# EAGLE design ISPnub_v1.0 (EAGLE 7.2.0)
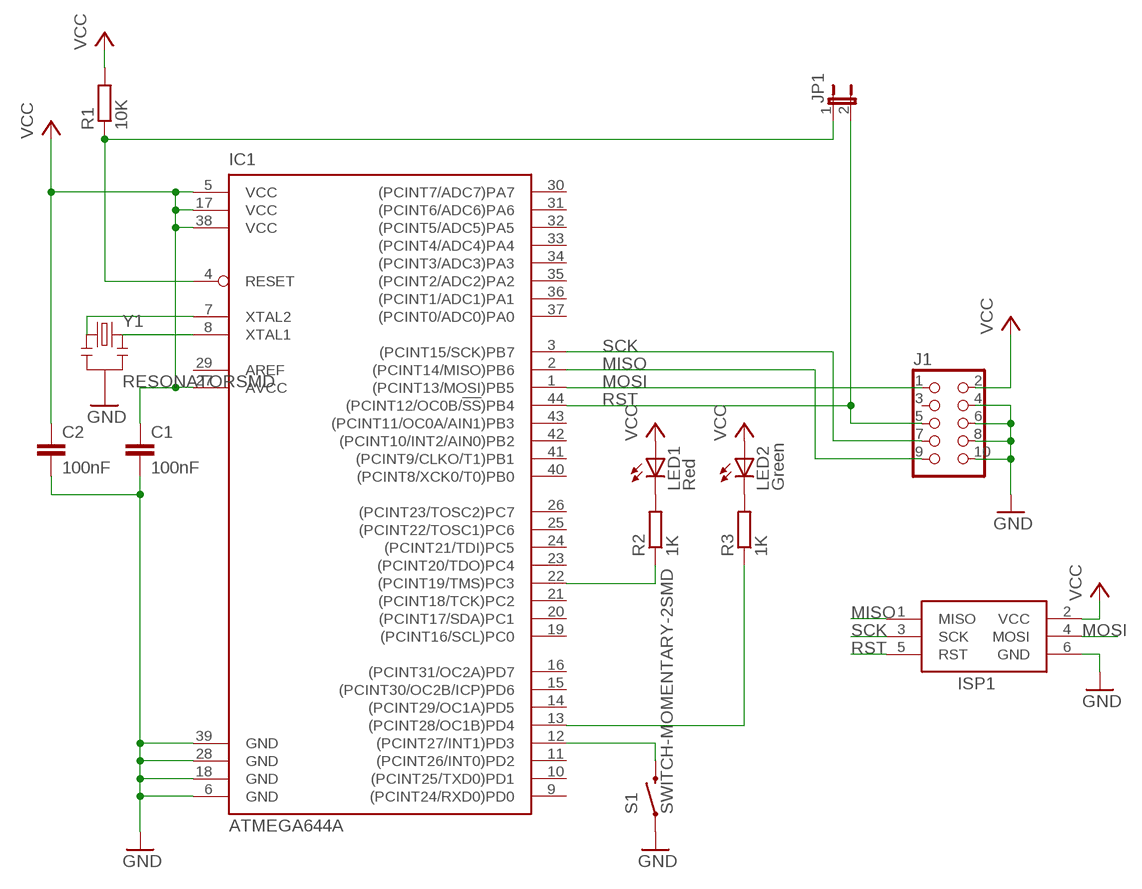
[diagram p0: schematic, sheet 1]

## Parts
C1  100nF  C-EUC0805  [C0805]
C2  100nF  C-EUC0805  [C0805]
IC1  ATMEGA644A  [TQFP44]
ISP1  AVRISP-BOX  [AVRISP-BOX]
J1  CON_HEADER_2X05-PTH+SHROUDED_A  [PINSHRD_PTH_2X05]
JP1  JP1E  [JP1]
LED1  Red  LEDCHIP-LED0805  [CHIP-LED0805]
LED2  Green  LEDCHIP-LED0805  [CHIP-LED0805]
R1  10K  R-EU_R0805  [R0805]
R2  1K  R-EU_R0805  [R0805]
R3  1K  R-EU_R0805  [R0805]
S1  SWITCH-MOMENTARY-2SMD  [TACTILE_SWITCH_SMD]
Y1  RESONATORSMD  [RESONATOR-SMD]

## Nets
GND: C1.2 C2.2 IC1.6(GND) IC1.18(GND) IC1.28(GND) IC1.39(GND) ISP1.6(GND) J1.4 J1.6 J1.8 J1.10 S1.1 Y1.2
MISO: IC1.2((PCINT14/MISO)PB6) ISP1.1(MISO) J1.9
MOSI: IC1.1((PCINT13/MOSI)PB5) ISP1.4(MOSI) J1.1
N$1: IC1.4(RESET) JP1.1 R1.1
N$2: IC1.8(XTAL1) Y1.3
N$3: IC1.7(XTAL2) Y1.1
N$4: IC1.12((PCINT27/INT1)PD3) S1.3
N$5: IC1.13((PCINT28/OC1B)PD4) R3.1
N$6: LED2.C R3.2
N$7: IC1.22((PCINT19/TMS)PC3) R2.1
N$8: LED1.C R2.2
RST: IC1.44((PCINT12/OC0B/!SS!)PB4) ISP1.5(RST) J1.5 JP1.2
SCK: IC1.3((PCINT15/SCK)PB7) ISP1.3(SCK) J1.7
VCC: C1.1 C2.1 IC1.5(VCC) IC1.17(VCC) IC1.27(AVCC) IC1.38(VCC) ISP1.2(VCC) J1.2 LED1.A LED2.A R1.2
Unconnected: IC1.9((PCINT24/RXD0)PD0) IC1.10((PCINT25/TXD0)PD1) IC1.11((PCINT26/INT0)PD2) IC1.14((PCINT29/OC1A)PD5) IC1.15((PCINT30/OC2B/ICP)PD6) IC1.16((PCINT31/OC2A)PD7) IC1.19((PCINT16/SCL)PC0) IC1.20((PCINT17/SDA)PC1) IC1.21((PCINT18/TCK)PC2) IC1.23((PCINT20/TDO)PC4) IC1.24((PCINT21/TDI)PC5) IC1.25((PCINT22/TOSC1)PC6) IC1.26((PCINT23/TOSC2)PC7) IC1.29(AREF) IC1.30((PCINT7/ADC7)PA7) IC1.31((PCINT6/ADC6)PA6) IC1.32((PCINT5/ADC5)PA5) IC1.33((PCINT4/ADC4)PA4) IC1.34((PCINT3/ADC3)PA3) IC1.35((PCINT2/ADC2)PA2) IC1.36((PCINT1/ADC1)PA1) IC1.37((PCINT0/ADC0)PA0) IC1.40((PCINT8/XCK0/T0)PB0) IC1.41((PCINT9/CLKO/T1)PB1) IC1.42((PCINT10/INT2/AIN0)PB2) IC1.43((PCINT11/OC0A/AIN1)PB3) J1.3

## Library data of the parts
C1 C2 = rcl:C-EU: CAPACITOR, European symbol; MOUSER#: 80-C0805C104K5R
IC1 = atmel:ATMEGA644: 8-bit Microcontroller with 64K Bytes In-System Programmable Flash Source: http://www.atmel.com/dyn/resources/prod_documents/doc2593.pdf; MOUSER#: 556-ATMEGA1284P-AU; MPN: ATMEGA1284PV-10AU; OC_FARNELL: 1455123; OC_NEWARK: 58M3748
ISP1 = adafruit:AVRISP: AVR ISP HEADER Standard 6 pin header for AVR programming
J1 = dp_devices:CON_HEADER_2X05: 2x05 pin header; MOUSER#: 517-N2510-5002RB
JP1 = jumper:JP1E: JUMPER; MOUSER#: 571-826936-2
LED1 = led:LED: LED OSRAM: - CHIPLED LG R971, LG N971, LY N971, LG Q971, LY Q971, LO R971, LY R971 LH N974, LH R974 LS Q976, LO Q976, LY Q976 LO Q996 - Hyper CHIPLED LW Q18S LB Q993, LB Q99A, LB R99A - SideLED LS A670, LO A670, LY A670, LG A670, LP A670 LB A673, LV A673, LT A673, LW A673 LH A674 LY A675 LS A676, LA A676, LO A676, LY A676, LW A676 LS A679, LY A679, LG A679 - Hyper Micro SIDELED® LS Y876, LA Y876, LO Y876, LY Y876 LT Y87S - SmartLED LW L88C, LW L88S LB L89C, LB L89S, LG L890 LS L89K, LO L89K, LY L89K LS L896, LA L896, LO L896, LY L896 - TOPLED LS T670, LO T670, LY T670, LG T670, LP T670 LSG T670, LSP T670, LSY T670, LOP T670, LYG T670 LG T671, LOG T671, LSG T671 LB T673, LV T673, LT T673, LW T673 LH T674 LS T676, LA T676, LO T676, LY T676, LB T676, LH T676, LSB T676, LW T676 LB T67C, LV T67C, LT T67C, LS T67K, LO T67K, LY T67K, LW E67C LS E67B, LA E67B, LO E67B, LY E67B, LB E67C, LV E67C, LT E67C LW T67C LS T679, LY T679, LG T679 LS T770, LO T770, LY T770, LG T770, LP T770 LB T773, LV T773, LT T773, LW T773 LH T774 LS E675, LA E675, LY E675, LS T675 LS T776, LA T776, LO T776, LY T776, LB T776 LHGB T686 LT T68C, LB T68C - Hyper Mini TOPLED® LB M676 - Mini TOPLED Santana® LG M470 LS M47K, LO M47K, LY M47K Source: http://www.osram.convergy.de LUXEON: - LUMILED® LXK2-PW12-R00, LXK2-PW12-S00, LXK2-PW14-U00, LXK2-PW14-V00 LXK2-PM12-R00, LXK2-PM12-S00, LXK2-PM14-U00 LXK2-PE12-Q00, LXK2-PE12-R00, LXK2-PE12-S00, LXK2-PE14-T00, LXK2-PE14-U00 LXK2-PB12-K00, LXK2-PB12-L00, LXK2-PB12-M00, LXK2-PB14-N00, LXK2-PB14-P00, LXK2-PB14-Q00 LXK2-PR12-L00, LXK2-PR12-M00, LXK2-PR14-Q00, LXK2-PR14-R00 LXK2-PD12-Q00, LXK2-PD12-R00, LXK2-PD12-S00 LXK2-PH12-R00, LXK2-PH12-S00 LXK2-PL12-P00, LXK2-PL12-Q00, LXK2-PL12-R00 Source: www.luxeon.com KINGBRIGHT: KA-3528ASYC Source: www.kingbright.com; MOUSER#: 604-APT1608SURC
LED2 = led:LED: LED OSRAM: - CHIPLED LG R971, LG N971, LY N971, LG Q971, LY Q971, LO R971, LY R971 LH N974, LH R974 LS Q976, LO Q976, LY Q976 LO Q996 - Hyper CHIPLED LW Q18S LB Q993, LB Q99A, LB R99A - SideLED LS A670, LO A670, LY A670, LG A670, LP A670 LB A673, LV A673, LT A673, LW A673 LH A674 LY A675 LS A676, LA A676, LO A676, LY A676, LW A676 LS A679, LY A679, LG A679 - Hyper Micro SIDELED® LS Y876, LA Y876, LO Y876, LY Y876 LT Y87S - SmartLED LW L88C, LW L88S LB L89C, LB L89S, LG L890 LS L89K, LO L89K, LY L89K LS L896, LA L896, LO L896, LY L896 - TOPLED LS T670, LO T670, LY T670, LG T670, LP T670 LSG T670, LSP T670, LSY T670, LOP T670, LYG T670 LG T671, LOG T671, LSG T671 LB T673, LV T673, LT T673, LW T673 LH T674 LS T676, LA T676, LO T676, LY T676, LB T676, LH T676, LSB T676, LW T676 LB T67C, LV T67C, LT T67C, LS T67K, LO T67K, LY T67K, LW E67C LS E67B, LA E67B, LO E67B, LY E67B, LB E67C, LV E67C, LT E67C LW T67C LS T679, LY T679, LG T679 LS T770, LO T770, LY T770, LG T770, LP T770 LB T773, LV T773, LT T773, LW T773 LH T774 LS E675, LA E675, LY E675, LS T675 LS T776, LA T776, LO T776, LY T776, LB T776 LHGB T686 LT T68C, LB T68C - Hyper Mini TOPLED® LB M676 - Mini TOPLED Santana® LG M470 LS M47K, LO M47K, LY M47K Source: http://www.osram.convergy.de LUXEON: - LUMILED® LXK2-PW12-R00, LXK2-PW12-S00, LXK2-PW14-U00, LXK2-PW14-V00 LXK2-PM12-R00, LXK2-PM12-S00, LXK2-PM14-U00 LXK2-PE12-Q00, LXK2-PE12-R00, LXK2-PE12-S00, LXK2-PE14-T00, LXK2-PE14-U00 LXK2-PB12-K00, LXK2-PB12-L00, LXK2-PB12-M00, LXK2-PB14-N00, LXK2-PB14-P00, LXK2-PB14-Q00 LXK2-PR12-L00, LXK2-PR12-M00, LXK2-PR14-Q00, LXK2-PR14-R00 LXK2-PD12-Q00, LXK2-PD12-R00, LXK2-PD12-S00 LXK2-PH12-R00, LXK2-PH12-S00 LXK2-PL12-P00, LXK2-PL12-Q00, LXK2-PL12-R00 Source: www.luxeon.com KINGBRIGHT: KA-3528ASYC Source: www.kingbright.com; MOUSER#: 604-APT2012SGC
R1 = rcl:R-EU_: RESISTOR, European symbol; MOUSER#: 603-SR0805JR-0710KL
R2 R3 = rcl:R-EU_: RESISTOR, European symbol; MOUSER#: 71-CRCW0805-1.0K-E3
S1 = Arduino-Pro-Mini-v14Arduino-Pro-Mini:SWITCH-MOMENTARY-2: Various NO switches- pushbuttons, reed, etc; MOUSER#: 693-1301.9314; PROD_ID: SWCH-08247
Y1 = Arduino-Pro-Mini-v14Arduino-Pro-Mini:RESONATOR: Resonator Small SMD resonator. This is the itty bitty 10/20MHz resonators with built in caps. CSTCE10M0G55 and CSTCE20M0V53. Footprint for SMD has been used in SFE production for years, and does work okay. 1:1 is an attempt to get larger fillets on the sides so it will be easier to inspect these solders in our AOI machine. The pads have been minimized to match the actual metal under the resonator. To see this relation, it includes an image import of the bottom side of the component. Imported to scale on layer 200.

## Board
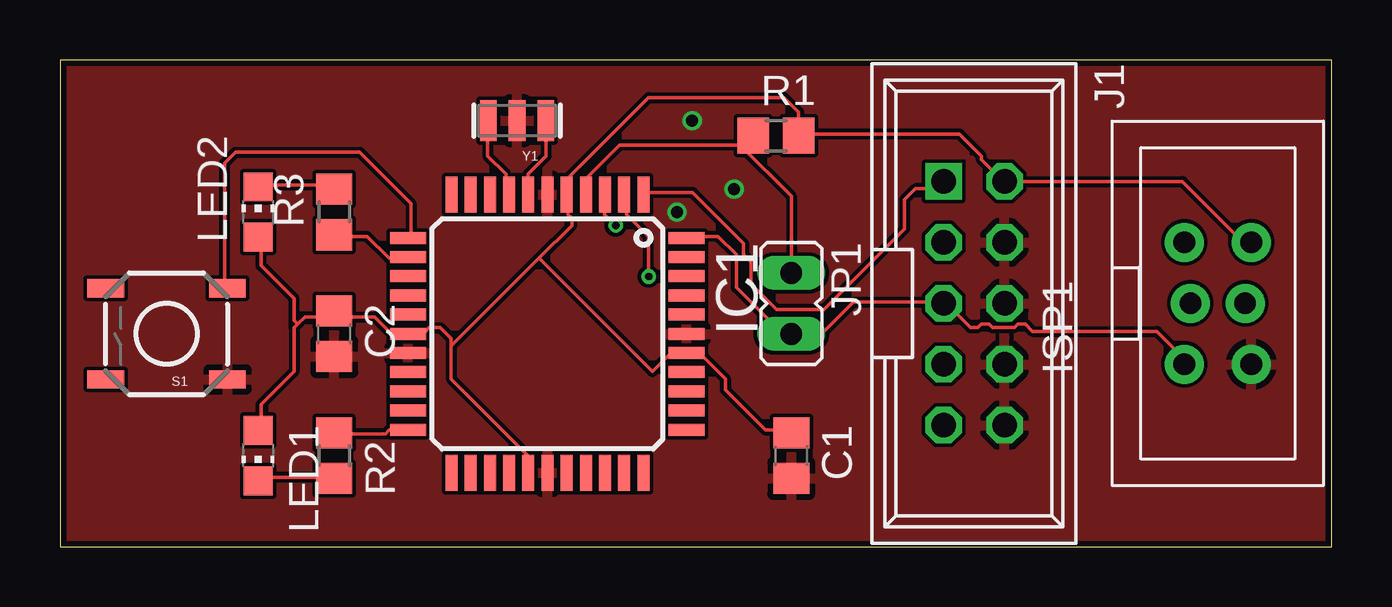
[diagram p1: board, top side]
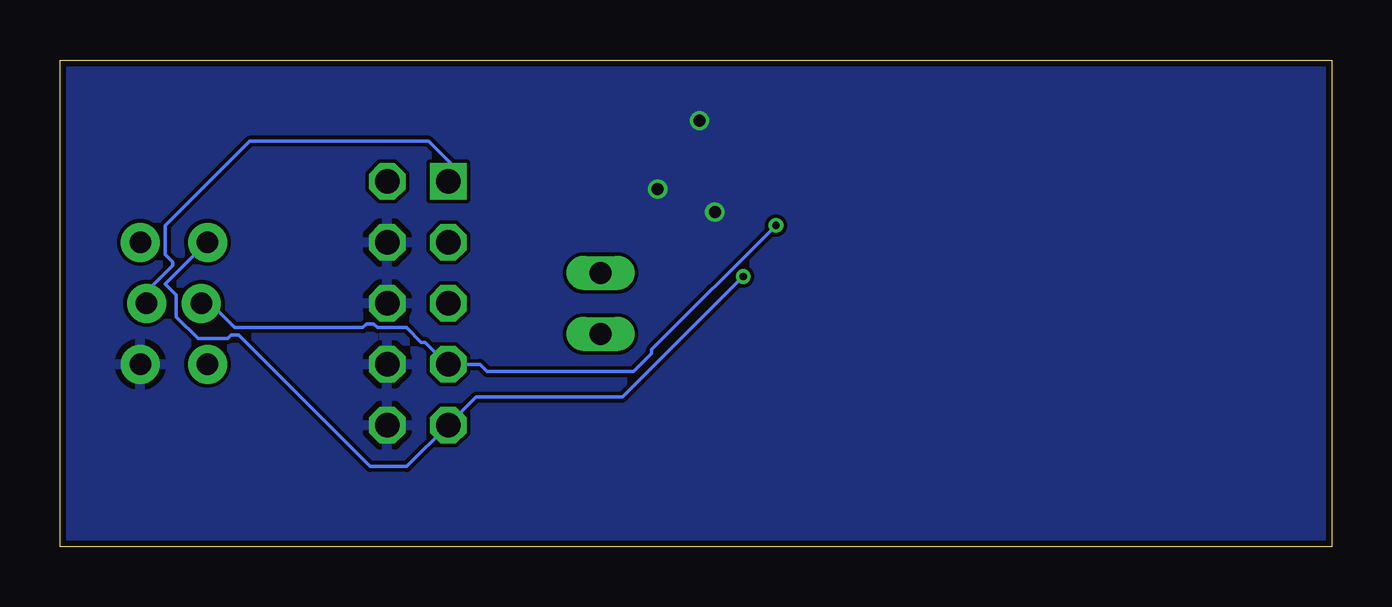
[diagram p2: board, bottom side, seen from below]

Size 53.01 x 20.31 mm. Coordinates in mm from the lower left corner, seen from the top.
Outline: 0,0 53.01,0 53.01,20.31 0,20.31 0,0
Copper layers (1*16): Top 0.035mm / dielectric 1.5mm / Bottom 0.035mm
Design rules "Elecrow_2-layer_eagle_rule": minimum track width 6mil, minimum drill 12mil, track to track 6mil, track to pad 6mil, pad to pad 6mil, via to via 6mil, smd to smd 0mil, copper to edge 10mil, drill to drill 10mil, minimum pad ring 10mil, minimum via ring 6mil, stop-mask expansion 2mil, vias tented up to drill 100mil, thermal gap 10mil

### Footprints (pad centres in the part's own frame; a part is rotated, then mirrored left to right if it is on the bottom)
C0805 = smd 1.3 x 1.5: 1 -0.95,0; 2 0.95,0
TQFP44 = smd 1.5 x 0.5: 1 -5.8,4; 2 -5.8,3.2; 3 -5.8,2.4; 4 -5.8,1.6; 5 -5.8,0.8; 6 -5.8,0; 7 -5.8,-0.8; 8 -5.8,-1.6; 9 -5.8,-2.4; 10 -5.8,-3.2; 11 -5.8,-4; 23 5.8,-4; 24 5.8,-3.2; 25 5.8,-2.4; 26 5.8,-1.6; 27 5.8,-0.8; 28 5.8,0; 29 5.8,0.8; 30 5.8,1.6; 31 5.8,2.4; 32 5.8,3.2; 33 5.8,4 | smd 0.5 x 1.5: 12 -4,-5.8; 13 -3.2,-5.8; 14 -2.4,-5.8; 15 -1.6,-5.8; 16 -0.8,-5.8; 17 0,-5.8; 18 0.8,-5.8; 19 1.6,-5.8; 20 2.4,-5.8; 21 3.2,-5.8; 22 4,-5.8; 34 4,5.8; 35 3.2,5.8; 36 2.4,5.8; 37 1.6,5.8; 38 0.8,5.8; 39 0,5.8; 40 -0.8,5.8; 41 -1.6,5.8; 42 -2.4,5.8; 43 -3.2,5.8; 44 -4,5.8
AVRISP-BOX = drill 0.9 pad 1.626: 1 -1.397,2.54; 2 1.397,2.54; 3 -1.143,0; 4 1.143,0; 5 -1.397,-2.54; 6 1.397,-2.54
PINSHRD_PTH_2X05 = drill 1.016 square: 1 -5.08,-1.27 | drill 1.016 octagon: 2 -5.08,1.27; 3 -2.54,-1.27; 4 -2.54,1.27; 5 0,-1.27; 6 0,1.27; 7 2.54,-1.27; 8 2.54,1.27; 9 5.08,-1.27; 10 5.08,1.27
JP1 = drill 0.914 long: 1 0,-1.27; 2 0,1.27
CHIP-LED0805 = smd 1.2 x 1.2: A 0,-1.05; C 0,1.05
R0805 = smd 1.3 x 1.5: 1 -0.95,0; 2 0.95,0
TACTILE_SWITCH_SMD = smd 1.524 x 0.762: 1 -2.54,1.905; 2 2.54,1.905; 3 -2.54,-1.905; 4 2.54,-1.905
RESONATOR-SMD = smd 0.7 x 1.7: 1 -1.2,0; 2 0,0; 3 1.2,0

### Placement (x,y rotation side)
C1  30.48,3.81 270 top
C2  11.43,8.89 270 top
IC1  20.32,8.89 270 top
ISP1  48.26,10.16 0 top
J1  38.1,10.16 270 top
JP1  30.48,10.16 180 top
LED1  8.26,3.81 180 top
LED2  8.26,13.97 0 top
R1  29.84,17.14 0 top
R2  11.43,3.81 270 top
R3  11.43,13.97 90 top
S1  4.45,8.89 180 top
Y1  19.05,17.78 180 top

### Tracks (layer width: path | path; a pad name or v marks a point on that pad's centre or on a via)
GND  (via drill 0.5)
  other vias: 28.1,14.92 26.35,17.78 25.72,13.97
  pour Top: 0,0 53.34,0 53.34,20.32 0,20.32
  pour Bottom: 0,0 53.34,0 53.34,20.32 0,20.32
MISO  (via drill 0.3)
  Top 0.152: v24.54,11.28 24.54,12.95 23.62,13.87 23.62,14.63 IC1.2
  Bottom 0.152: v24.54,11.28 29.57,6.25 35.66,6.25 J1.9 38.56,3.35 40.08,3.35 45.57,8.84 45.87,8.84 46.02,8.69 47.24,8.69 48.16,9.6 48.16,10.52 48.62,10.97 46.94,12.65 ISP1.1
MOSI
  Top 0.152: IC1.1 24.38,14.78 26.36,14.78 28.5,12.65 28.5,12.19 28.8,11.89 28.8,10.97 29.87,9.91 31.85,9.91 35.2,13.26 35.2,14.48 35.66,14.94 36.42,14.94 36.73,15.24 J1.1
  Bottom 0.152: ISP1.4 49.38,10.21 49.38,10.67 48.31,11.73 48.31,11.89 48.62,12.19 48.62,13.41 45.11,16.92 37.64,16.92 36.73,16 36.73,15.24 J1.1
N$1
  Top 0.152: 28.35,16.76 28.5,16.76 28.8,17.07 R1.1 28.35,16.76 | 28.35,16.76 23.32,16.76 21.95,15.39 21.95,14.78 IC1.4 | JP1.1 30.48,14.63 28.35,16.76
N$2
  Top 0.152: IC1.8 18.59,14.78 18.59,15.54 17.83,16.31 17.83,17.68 Y1.3
N$3
  Top 0.152: IC1.7 19.51,14.78 19.51,15.54 19.81,15.85 19.81,15.84 20.27,16.3 20.27,17.68 Y1.1
N$4
  Top 0.152: IC1.12 14.63,12.95 14.63,14.33 12.5,16.46 7.32,16.46 6.86,16 6.86,10.82 S1.3
N$5
  Top 0.152: R3.1 11.43,12.95 12.8,12.95 13.72,12.04 14.48,12.04 IC1.13
N$6
  Top 0.152: LED2.C 8.38,15.09 11.28,15.09 11.43,14.94 R3.2
N$7
  Top 0.152: R2.1 11.43,4.72 13.56,4.72 13.72,4.88 14.48,4.88 IC1.22
N$8
  Top 0.152: LED1.C 8.38,2.9 11.43,2.9 R2.2
RST
  Top 0.152: 30.48,8.99 30.02,8.99 28.19,10.82 28.19,12.19 27.43,12.95 26.21,12.95 IC1.44 | 30.48,8.99 31.85,8.99 33.07,10.21 36.73,10.21 J1.5 36.88,10.21 37.95,9.14 38.25,9.14 38.41,9.3 38.71,9.3 38.86,9.14 39.78,9.14 39.93,9.3 40.23,9.3 40.54,8.99 45.72,8.99 46.79,7.92 46.79,7.62 ISP1.5 | 30.48,8.99 JP1.2
SCK  (via drill 0.3)
  Top 0.152: v23.16,13.41 22.71,13.87 22.71,14.63 IC1.3
  Bottom 0.152: v23.16,13.41 28.35,8.23 28.35,8.08 29.11,7.32 35.2,7.32 35.51,7.62 J1.7 36.88,7.62 37.8,8.53 37.95,8.53 38.56,9.14 39.78,9.14 39.93,9.3 40.23,9.3 40.39,9.14 45.72,9.14 46.63,10.06 47.09,10.06 ISP1.3
VCC
  Top 0.152: ISP1.2 49.53,12.8 49.23,12.8 46.79,15.24 J1.2 39.32,15.24 38.41,16.15 38.41,16.31 37.49,17.22 30.94,17.22 R1.2 30.79,17.22 30.79,18.14 30.18,18.75 24.54,18.75 21.18,15.39 21.18,14.78 IC1.5 21.18,14.63 21.18,13.87 21.34,13.72 21.34,13.41 19.96,12.04 | C1.1 30.48,4.88 29.41,4.88 27.74,6.55 27.74,7.01 26.67,8.08 26.21,8.08 IC1.38 26.06,8.08 25.45,8.08 24.69,7.32 19.96,12.04 | 9.91,9.3 10.21,9.6 11.28,9.6 | 9.91,9.3 9.75,9.14 9.75,7.32 8.38,5.94 8.38,4.88 LED1.A | 11.28,9.6 11.43,9.75 C2.1 11.28,9.6 | 9.91,9.3 9.75,9.45 9.75,10.36 8.38,11.73 8.38,12.8 LED2.A | 11.28,9.6 13.11,9.6 13.72,8.99 14.48,8.99 IC1.17 14.63,8.99 15.24,8.99 15.39,9.14 15.85,9.14 16.31,8.69 16.31,8.38 | 16.31,8.38 16.31,7.01 19.51,3.81 19.51,3.2 IC1.27 | 16.31,8.38 19.96,12.04